# Altium schematic sheet Shutdown.SchDoc
size A
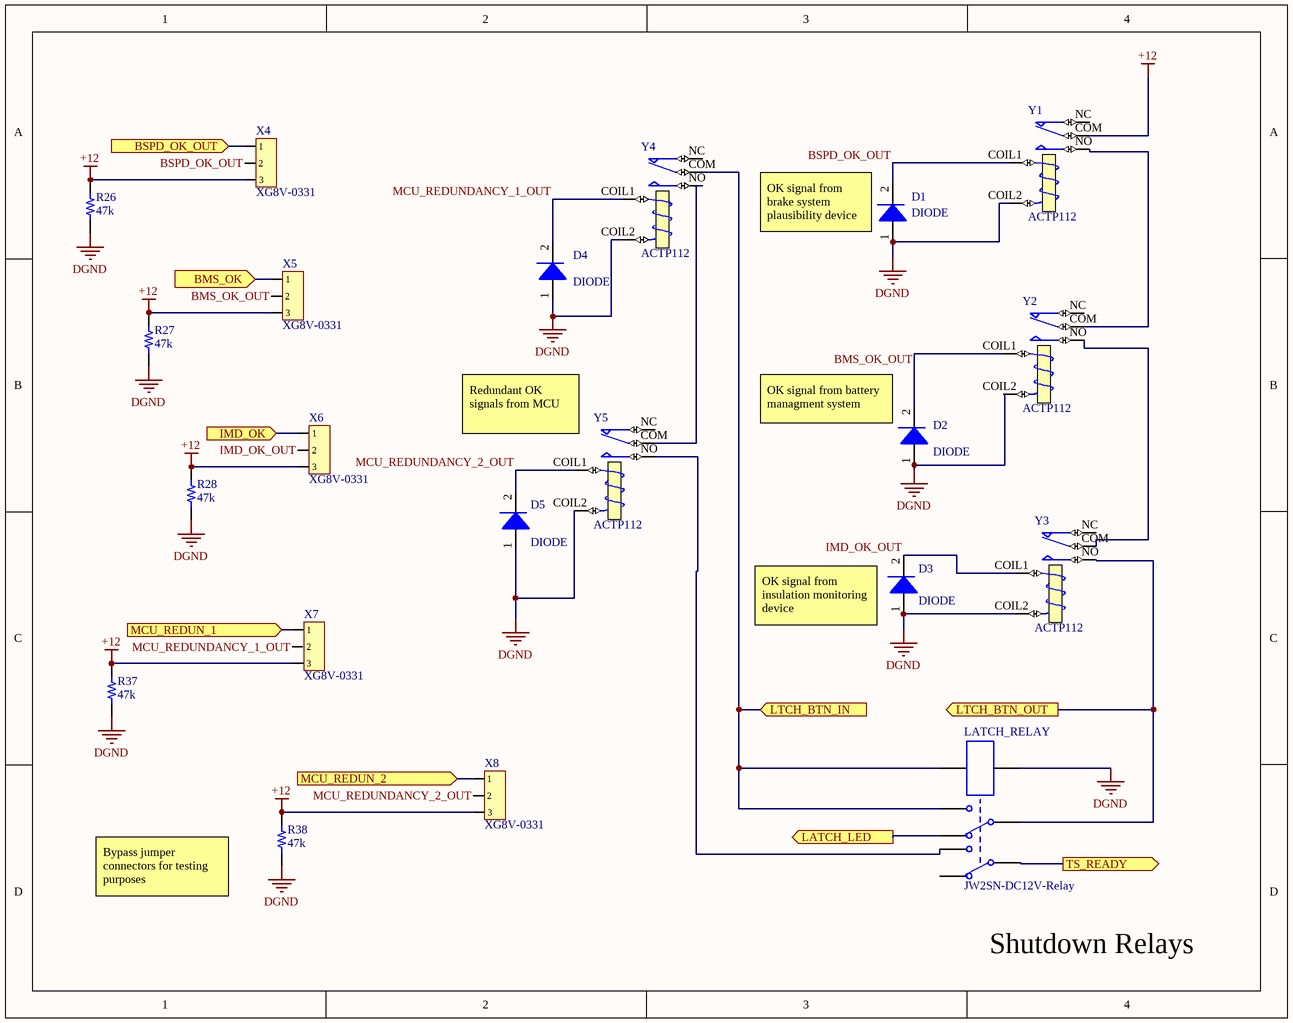
[diagram p0: Shutdown.SchDoc]

## Parts
D1  DIODE  [SOD123F]
D2  DIODE  [SOD123F]
D3  DIODE  [SOD123F]
D4  DIODE  [SOD123F]
D5  DIODE  [SOD123F]
LATCH_RELAY  JW2SN-DC12V-Relay  [JW2SN-DC12V-Relay]
R26  value 47k  [RES 0805/2012]  (hidden comment: Resistor 47k 0805 1/4W 5%)
R27  value 47k  [RES 0805/2012]  (hidden comment: Resistor 47k 0805 1/4W 5%)
R28  value 47k  [RES 0805/2012]  (hidden comment: Resistor 47k 0805 1/4W 5%)
R37  value 47k  [RES 0805/2012]  (hidden comment: Resistor 47k 0805 1/4W 5%)
R38  value 47k  [RES 0805/2012]  (hidden comment: Resistor 47k 0805 1/4W 5%)
X4  XG8V-0331  [XG8V-0331]
X5  XG8V-0331  [XG8V-0331]
X6  XG8V-0331  [XG8V-0331]
X7  XG8V-0331  [XG8V-0331]
X8  XG8V-0331  [XG8V-0331]
Y1  ACTP112  [ACTP112]
Y2  ACTP112  [ACTP112]
Y3  ACTP112  [ACTP112]
Y4  ACTP112  [ACTP112]
Y5  ACTP112  [ACTP112]

## Ports
BMS_OK (in), BSPD_OK_OUT (in), IMD_OK (in), LATCH_LED (out), LTCH_BTN_IN (in), LTCH_BTN_OUT (out), MCU_REDUN_1 (in), MCU_REDUN_2 (in), TS_READY (out)

## Nets
+12: R26.2 R27.2 R28.2 R37.2 R38.2 X4.3 X5.3 X6.3 X7.3 X8.3 Y1.COM
DGND: D1.1(A) D2.1(A) D3.1(A) D4.1(A) D5.1(A) LATCH_RELAY.1(COIL1) R26.1 R27.1 R28.1 R37.1 R38.1 Y1.COIL2(T2) Y2.COIL2(T2) Y3.COIL2(T2) Y4.COIL2(T2) Y5.COIL2(T2)
BMS_OK: X5.1 ; port BMS_OK
BMS_OK_OUT: D2.2(K) X5.2 Y2.COIL1(T1)
BSPD_OK_OUT: X4.1 ; port BSPD_OK_OUT
BSPD_OK_OUT: X4.2  [a separate net that carries the same name]
IMD_OK: X6.1 ; port IMD_OK
IMD_OK_OUT: D3.2(K) X6.2 Y3.COIL1(T1)
LATCH_LED: LATCH_RELAY.2(N.C1) ; port LATCH_LED
LTCH_BTN_IN: LATCH_RELAY.4(N.O1) LATCH_RELAY.8(COIL2) Y4.COM ; port LTCH_BTN_IN
LTCH_BTN_OUT: LATCH_RELAY.3(COM1) Y3.NO ; port LTCH_BTN_OUT
MCU_REDUN_1: X7.1 ; port MCU_REDUN_1
MCU_REDUN_2: X8.1 ; port MCU_REDUN_2
MCU_REDUNDANCY_1_OUT: D4.2(K) X7.2 Y4.COIL1(T1)
MCU_REDUNDANCY_2_OUT: D5.2(K) X8.2 Y5.COIL1(T1)
TS_READY: LATCH_RELAY.6(COM2) ; port TS_READY
NetD1_2: D1.2(K) Y1.COIL1(T1)
NetLATCH_RELAY_5: LATCH_RELAY.5(N.O2) Y5.NO
NetY1_NO: Y1.NO Y2.COM
NetY2_NO: Y2.NO Y3.COM
NetY4_NO: Y4.NO Y5.COM

Not connected (* = marked no-connect by the designer): LATCH_RELAY 7(N.C2); Y1 NC; Y2 NC; Y3 NC; Y4 NC; Y5 NC

## Notes on the sheet
- (near D1) OK signal from brake system plausibility device
- (near Y5) Redundant OK signals from MCU
- (near D2) OK signal from battery managment system
- (near D3) OK signal from insulation monitoring device
- (near R38) Bypass jumper connectors for testing purposes
- (near LATCH_RELAY) Shutdown Relays
- Labels drawn without touching a wire or pin: BSPD_OK_OUT

## Library data of the parts
D1-D5 = 9: idDiode: 9
LATCH_RELAY = 2: Manufacturer_id: 1; idRelay: 2; Name: Relay JW2SN-DC12; Drawer_id: 1
R26-R28 R37 R38 = 1841: Manufacturer_id: 1; idResistor: 1841; Name: Res_47k_0805_1/4W_5%; Created_By: Nick Mah; Supplier 1: Digi-Key; Drawer_id: 1; Tolerance: 5%; Power: 1/4W; Package: 0805; ComponentLink1Description: Datasheet; Created_Date: 2018-10-20
X4-X8 = 8: 3 pin header; Manufacturer_id: 1; idConn: 8; Name: XG8V-0331_3pin_header; Num_Contacts: 3; Pitch: 2.54 mm; Drawer_id: 1; Link: https://www.digikey.com/products/en/connectors-interconnects/rectangular-connectors-headers-male-pins/314?k=jumper&k=&pkeyword=jumper&pv88=5&sf=0&FV=ffe0013a&quantity=&ColumnSort=0&page=1&pageSize=25; ComponentLink1Description: Datasheet
Y1-Y5 = 3: Manufacturer_id: 1; idRelay: 3; Coil_Voltage: 12V; Published: 8-Jun-2000; LatestRevisionDate: 17-Jul-2002; LatestRevisionNote: Re-released for DXP Platform.; PackageReference: MODULE5B; Publisher: Altium Limited; Drawer_id: 1; Name: ACTP112